# EAGLE design ver001 (EAGLE 7.2.0)
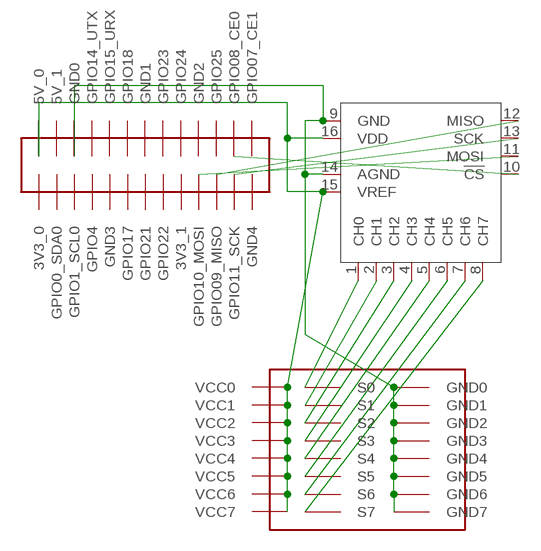
[diagram p0: schematic, sheet 1]

## Parts
U$1  RPI_26  [RPI26]
U$2  MCP3008P  [DIL16]
U$3  3BY8  [3BY8HEADER]

## Nets
N$1: U$2.1(CH0) U$3.S0
N$2: U$2.10(!CS)
N$3: U$2.2(CH1) U$3.S1
N$4: U$2.3(CH2) U$3.S2
N$5: U$2.4(CH3) U$3.S3
N$6: U$2.5(CH4) U$3.S4
N$7: U$1.GPIO11(GPIO11_SCK) U$2.13(SCK)
N$8: U$1.GPIO09(GPIO09_MISO) U$2.12(MISO)
N$9: U$2.6(CH5) U$3.S5
N$10: U$1.GPIO10(GPIO10_MOSI) U$2.11(MOSI)
N$11: U$2.7(CH6) U$3.S6
N$12: U$2.8(CH7) U$3.S7
N$14: U$1.5V0(5V_0) U$2.15(VREF) U$2.16(VDD) U$3.VCC0 U$3.VCC1 U$3.VCC2 U$3.VCC3 U$3.VCC4 U$3.VCC5 U$3.VCC6 U$3.VCC7
N$16: U$1.GND0 U$2.9(GND) U$2.14(AGND) U$3.GND0 U$3.GND1 U$3.GND2 U$3.GND3 U$3.GND4 U$3.GND5 U$3.GND6 U$3.GND7
Unconnected: U$1.3V3_0 U$1.3V3_1 U$1.5V1(5V_1) U$1.GND1 U$1.GND2 U$1.GND3 U$1.GND4 U$1.GPIO0(GPIO0_SDA0) U$1.GPIO01(GPIO1_SCL0) U$1.GPIO04(GPIO4) U$1.GPIO07(GPIO07_CE1) U$1.GPIO08(GPIO08_CE0) U$1.GPIO14(GPIO14_UTX) U$1.GPIO15(GPIO15_URX) U$1.GPIO17 U$1.GPIO18 U$1.GPIO21 U$1.GPIO22 U$1.GPIO23 U$1.GPIO24 U$1.GPIO25

## Library data of the parts
U$1 = jt_lib:RPI_26: RPi GPIO header (26 pin)
U$2 = MCP3008:MCP3008
U$3 = jt_lib:3BY8: a 3 by 8 header

## Board
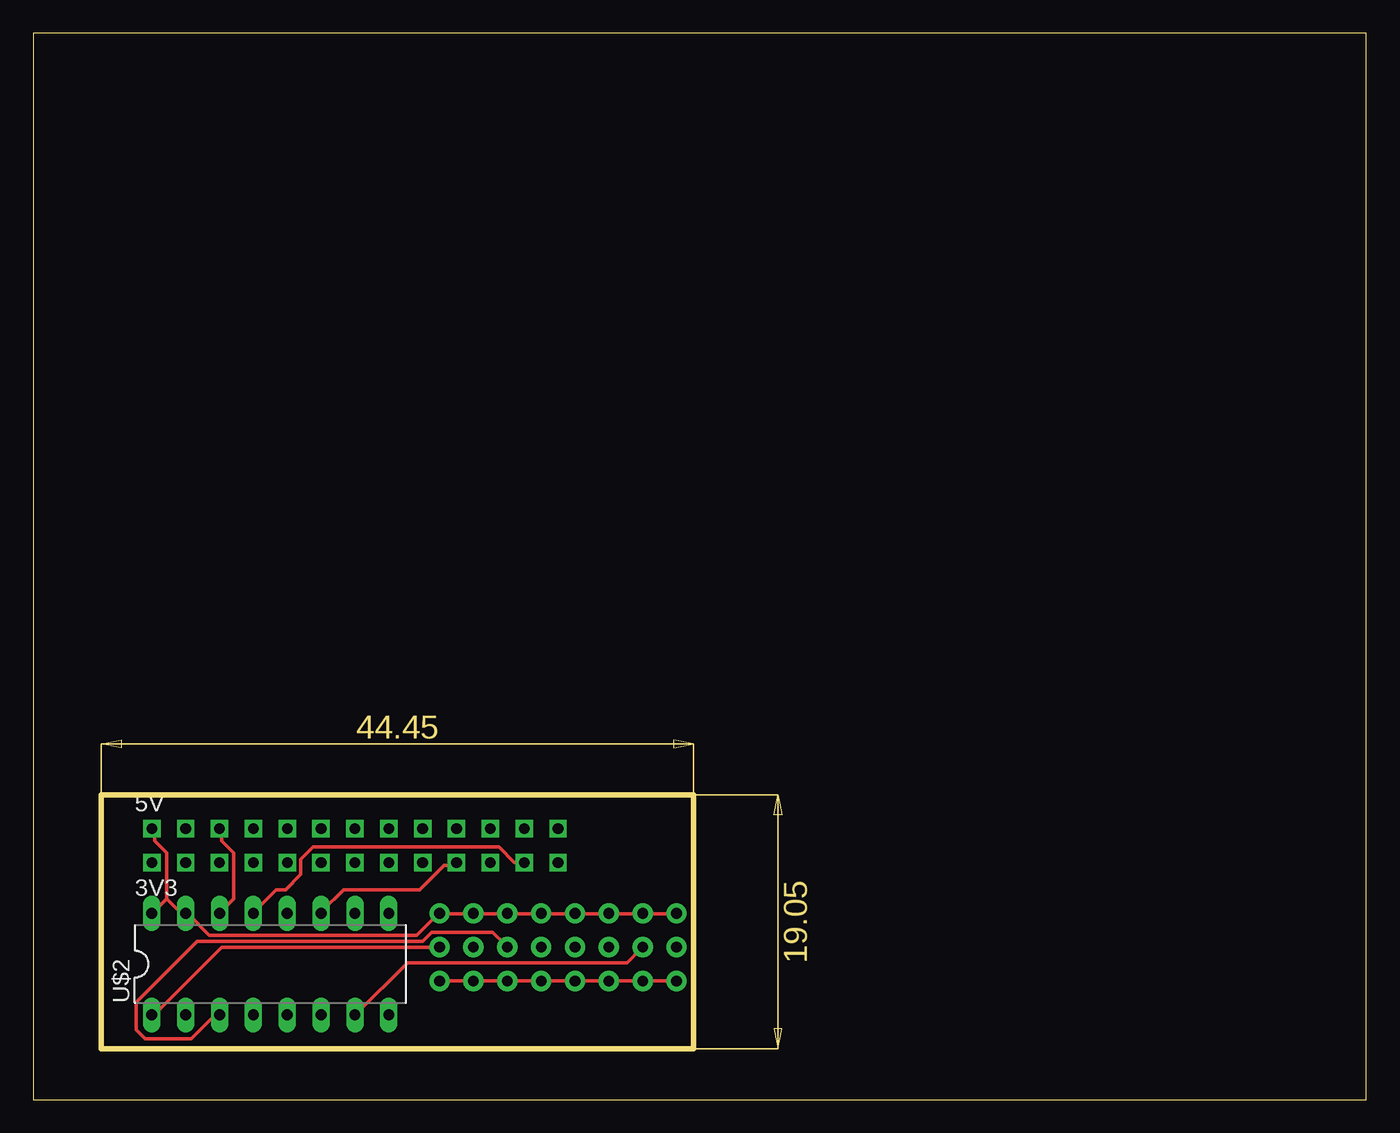
[diagram p1: board, top side]
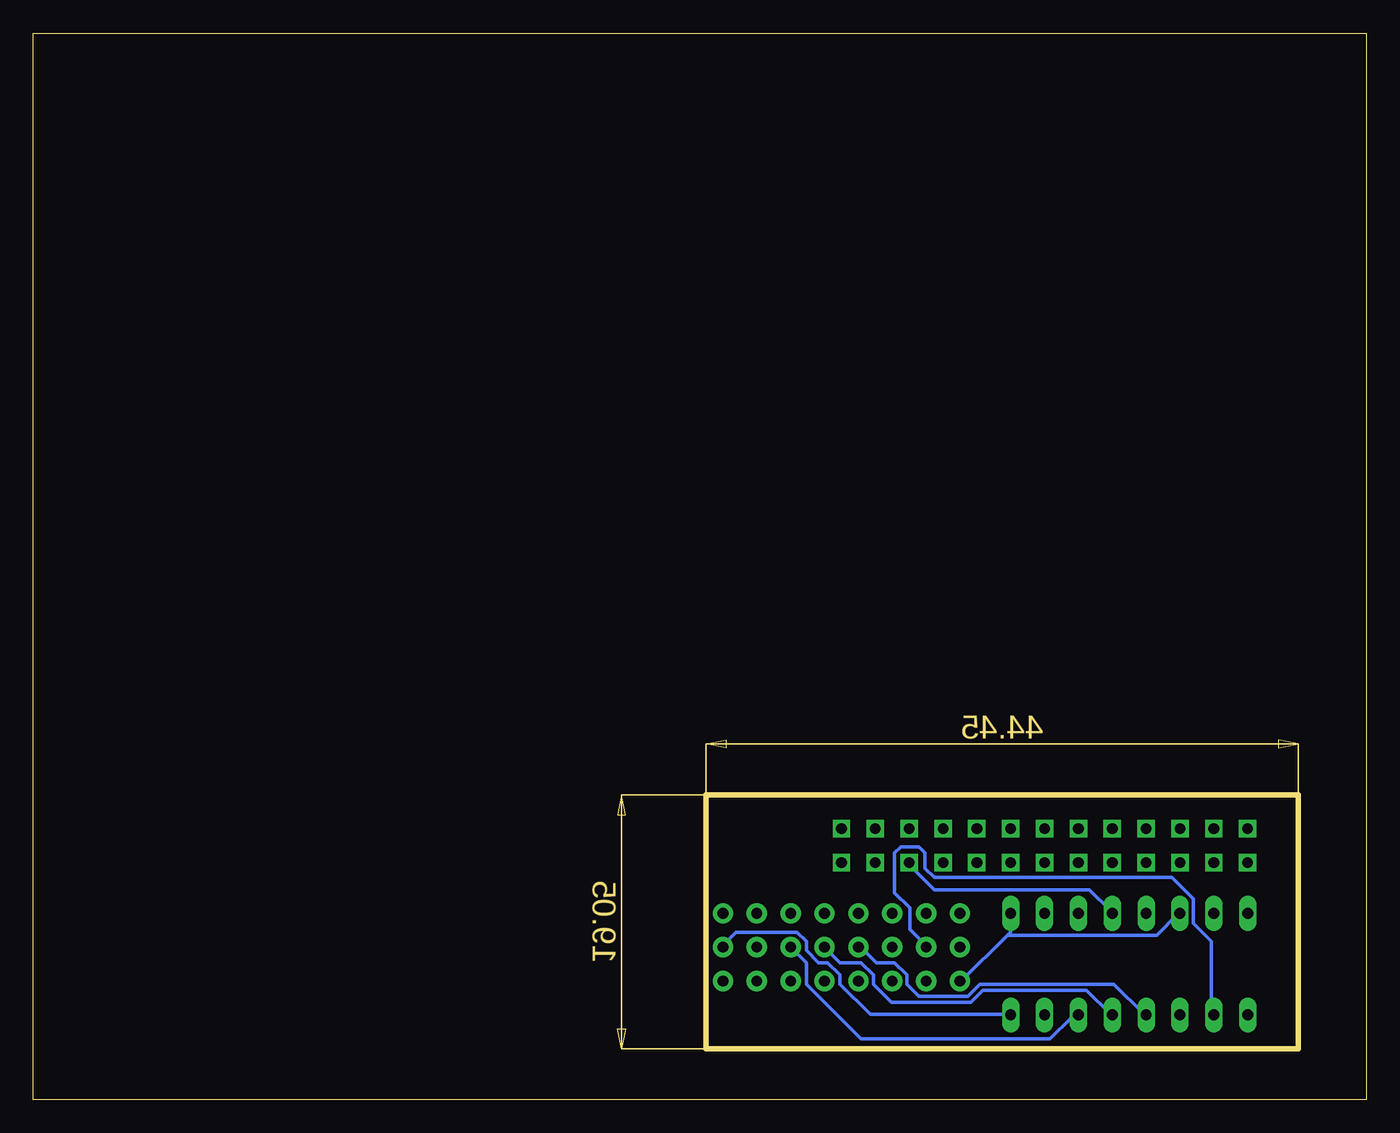
[diagram p2: board, bottom side, seen from below]

Size 100 x 80 mm. Coordinates in mm from the lower left corner, seen from the top.
Outline: 0,0 100,0 100,80 0,80 0,0
Outline: 5.08,22.86 5.08,3.81 49.53,3.81 49.53,22.86 5.08,22.86
Copper layers (1*16): Top 0.035mm / dielectric 1.5mm / Bottom 0.035mm
Design rules "default": minimum track width 10mil, minimum drill 24mil, track to track 8mil, track to pad 8mil, pad to pad 8mil, via to via 8mil, smd to smd 8mil, copper to edge 40mil, drill to drill 8mil, minimum pad ring 10mil, minimum via ring 8mil, stop-mask expansion 4mil, vias tented up to drill 0mil, thermal gap 10mil

### Footprints (pad centres in the part's own frame; a part is rotated, then mirrored left to right if it is on the bottom)
RPI26 = drill 0.8 square: 3V3_0 -13.97,-1.27; 3V3_1 6.35,-1.27; 5V0 -13.97,1.27; 5V1 -11.43,1.27; GND0 -8.89,1.27; GND1 1.27,1.27; GND2 8.89,1.27; GND3 -3.81,-1.27; GND4 16.51,-1.27; GPIO0 -11.43,-1.27; GPIO01 -8.89,-1.27; GPIO04 -6.35,-1.27; GPIO07 16.51,1.27; GPIO08 13.97,1.27; GPIO09 11.43,-1.27; GPIO10 8.89,-1.27; GPIO11 13.97,-1.27; GPIO14 -6.35,1.27; GPIO15 -3.81,1.27; GPIO17 -1.27,-1.27; GPIO18 -1.27,1.27; GPIO21 1.27,-1.27; GPIO22 3.81,-1.27; GPIO23 3.81,1.27; GPIO24 6.35,1.27; GPIO25 11.43,1.27
DIL16 = drill 0.813 long: 1 -8.89,-3.81; 2 -6.35,-3.81; 3 -3.81,-3.81; 4 -1.27,-3.81; 5 1.27,-3.81; 6 3.81,-3.81; 7 6.35,-3.81; 8 8.89,-3.81; 9 8.89,3.81; 10 6.35,3.81; 11 3.81,3.81; 12 1.27,3.81; 13 -1.27,3.81; 14 -3.81,3.81; 15 -6.35,3.81; 16 -8.89,3.81
3BY8HEADER = drill 0.8 pad 1.524: GND0 -5.08,-3.81; GND1 -2.54,-3.81; GND2 0,-3.81; GND3 2.54,-3.81; GND4 5.08,-3.81; GND5 7.62,-3.81; GND6 10.16,-3.81; GND7 12.7,-3.81; S0 -5.08,-1.27; S1 -2.54,-1.27; S2 0,-1.27; S3 2.54,-1.27; S4 5.08,-1.27; S5 7.62,-1.27; S6 10.16,-1.27; S7 12.7,-1.27; VCC0 -5.08,1.27; VCC1 -2.54,1.27; VCC2 0,1.27; VCC3 2.54,1.27; VCC4 5.08,1.27; VCC5 7.62,1.27; VCC6 10.16,1.27; VCC7 12.7,1.27

### Placement (x,y rotation side)
U$1  22.86,19.05 0 top
U$2  17.78,10.16 0 top
U$3  35.56,12.7 0 top

### Tracks (layer width: path | path; a pad name or v marks a point on that pad's centre or on a via)
N$1
  Top 0.254: U$2.1 9.09,6.38 14.12,11.4 30.35,11.4 U$3.S0
N$3
  Bottom 0.254: U$2.2 11.61,6.38 11.61,11.86 12.98,13.23 12.98,15.06 14.58,16.66 32.41,16.66 33.1,17.35 33.1,18.49 33.55,18.95 34.92,18.95 35.38,18.49 35.38,15.52 34.24,14.38 34.24,12.78 33.1,11.63 U$3.S1
N$4
  Top 0.254: U$2.3 13.89,6.15 13.44,6.15 11.84,4.55 8.41,4.55 7.72,5.23 7.72,7.29 12.29,11.86 29.21,11.86 29.9,12.55 34.47,12.55 35.38,11.63 U$3.S2
N$5
  Bottom 0.254: U$2.4 16.64,6.38 18.92,8.66 28.98,8.66 29.9,7.75 33.55,7.75 34.47,8.66 34.47,9.35 35.38,10.26 36.75,10.26 37.9,11.4 U$3.S3
N$6
  Bottom 0.254: U$2.5 19.15,6.38 20.98,8.2 28.75,8.2 29.67,7.29 35.61,7.29 36.98,8.66 36.98,9.35 37.9,10.26 39.5,10.26 40.64,11.4 U$3.S4
N$7
  Top 0.254: U$1.GPIO11 36.75,17.8 36.07,17.8 34.92,18.95 20.98,18.95 20.07,18.03 20.07,16.89 18.92,15.75 18.24,15.75 16.64,14.15 U$2.13
N$8
  Bottom 0.254: U$1.GPIO09 34.24,17.58 32.41,15.75 20.75,15.75 19.15,14.15 U$2.12
N$9
  Bottom 0.254: U$3.S5 42.01,10.26 42.01,8.66 37.9,4.55 23.72,4.55 22.12,6.15 21.67,6.15 U$2.6
N$10
  Top 0.254: U$1.GPIO10 31.73,17.58 30.81,17.58 28.98,15.75 23.27,15.75 21.67,14.15 U$2.11
N$11
  Top 0.254: U$2.7 24.18,6.38 28.07,10.26 44.53,10.26 45.67,11.4 U$3.S6
N$12
  Bottom 0.254: U$2.8 26.7,6.38 37.21,6.38 39.5,8.66 39.5,9.35 40.41,10.26 41.1,10.26 42.01,11.18 42.01,11.86 42.7,12.55 47.27,12.55 48.18,11.63 U$3.S7
N$14
  Top 0.254: 10.01,15.06 10.01,18.49 9.09,19.41 9.09,20.32 U$1.5V0 | 10.01,15.06 9.09,14.15 U$2.16 | 10.01,15.06 10.92,14.15 11.38,14.15 U$2.15 11.61,13.92 13.21,12.32 28.75,12.32 30.35,13.92 U$3.VCC0 30.58,13.92 32.87,13.92 U$3.VCC1 33.1,13.92 35.38,13.92 U$3.VCC2 35.61,13.92 37.9,13.92 U$3.VCC3 38.12,13.92 40.64,13.92 | U$3.VCC7 48.18,13.92 45.9,13.92 U$3.VCC6 45.67,13.92 43.38,13.92 U$3.VCC5 43.16,13.92 40.64,13.92 | 40.64,13.92 U$3.VCC4
N$16
  Top 0.254: U$3.GND7 U$3.GND6 U$3.GND5 U$3.GND4 U$3.GND3 U$3.GND2 U$3.GND1 U$3.GND0 | U$1.GND0 14.12,20.32 14.12,19.41 15.04,18.49 15.04,15.06 14.12,14.15 U$2.14
  Bottom 0.254: 26.92,12.32 30.35,8.89 U$3.GND0 | 26.92,12.32 26.7,12.55 26.7,13.92 U$2.9 | 26.92,12.32 15.72,12.32 14.12,13.92 U$2.14